# Altium schematic sheet 1_P1.schdoc
size 309 x 223 mm; Symbol: Sheet-Symbol_A4; Device: Sheet-Symbol_A4; @Page Name: P1; @Create Date: 2023-05-10; @Page Count: 1; @Page No: 1; @Project Name: 大创第一版1; @Schematic Name: Schematic1; @Update Date: 2023-05-30; Company: 嘉立创EDA; Page Size: A4; Version: V1.0
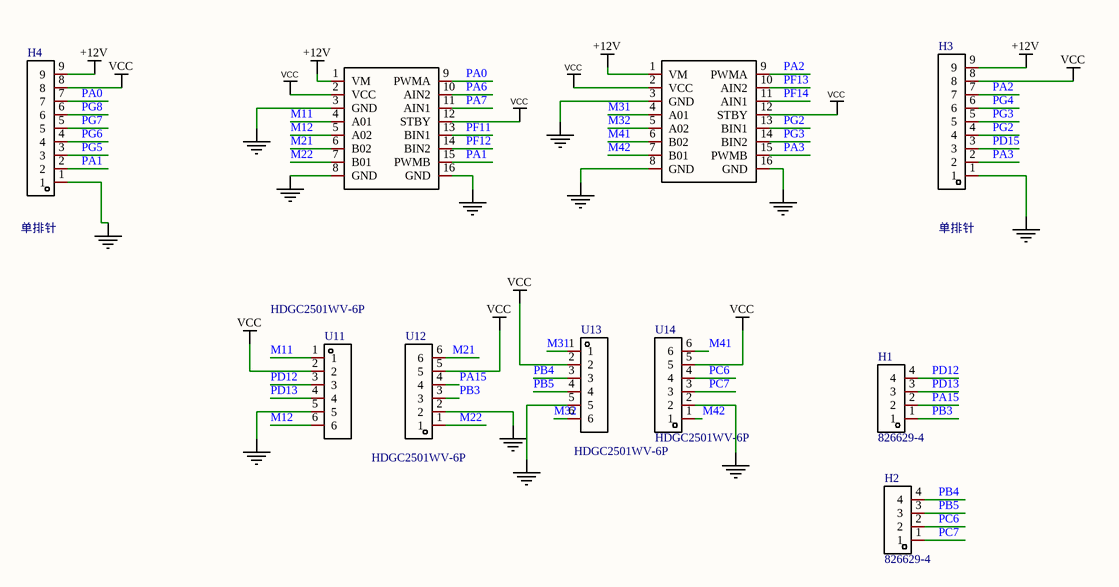
[diagram p0: 1_P1.schdoc]

## Parts
H1  826629-4  [HDR-TH_4P-P2.54-V-M-1]
H2  826629-4  [HDR-TH_4P-P2.54-V-M-1]
H3  单排针  [排针2.54MM9P]
H4  单排针  [排针2.54MM9P]
U7  TB6612  [TB6612]  (value not drawn)
U8  TB6612  [TB6612]  (value not drawn)
U11  HDGC2501WV-6P  [CONN-TH_XH2.54-6P]
U12  HDGC2501WV-6P  [CONN-TH_XH2.54-6P]
U13  HDGC2501WV-6P  [CONN-TH_XH2.54-6P]
U14  HDGC2501WV-6P  [CONN-TH_XH2.54-6P]

## Nets
+12V: H3.9 H4.9 U7.1(VM) U8.1(VM)
GND: H3.1 H4.1 U7.3(GND) U7.8(GND) U7.16(GND) U8.3(GND) U8.8(GND) U8.16(GND) U11.5 U12.2 U13.5 U14.2
VCC: H3.8 H4.8 U7.2(VCC) U7.12(STBY) U8.2(VCC) U8.12(STBY) U11.2 U12.5 U13.2 U14.5
M11: U7.4(A01) U11.1
M12: U7.5(A02) U11.6
M21: U7.6(B02) U12.6
M22: U7.7(B01) U12.1
M31: U8.4(A01) U13.1
M32: U8.5(A02) U13.6
M41: U8.6(B02) U14.6
M42: U8.7(B01) U14.1
PA0: H4.7 U7.9(PWMA)
PA1: H4.2 U7.15(PWMB)
PA2: H3.7 U8.9(PWMA)
PA3: H3.2 U8.15(PWMB)
PA6: U7.10(AIN2)
PA7: U7.11(AIN1)
PA15: H1.2 U12.4
PB3: H1.1 U12.3
PB4: H2.4 U13.3
PB5: H2.3 U13.4
PC6: H2.2 U14.4
PC7: H2.1 U14.3
PD12: H1.4 U11.3
PD13: H1.3 U11.4
PD15: H3.3
PF11: U7.13(BIN1)
PF12: U7.14(BIN2)
PF13: U8.10(AIN2)
PF14: U8.11(AIN1)
PG2: H3.4 U8.13(BIN1)
PG3: H3.5 U8.14(BIN2)
PG4: H3.6
PG5: H4.3
PG6: H4.4
PG7: H4.5
PG8: H4.6

## Notes on the sheet
- 1
- 2
- 3
- 4
- 5
- 6
- A
- B
- C
- Schematic
- Schematic1
- Create Date
- Update Date
- 2023-05-10
- 2023-05-30
- Reviewed
- Drawed
- Page
- P1
- Part Number
- 大创第一版1
- D
- VER
- SIZE
- PAGE
- OF
- V1.0
- A4
- 嘉立创EDA

## Library data of the parts
H1 H2 = 排针2: 排数:单排;总PIN位数:4;间距:2.54mm;插针结构:1x4P;行距:-;安装类型:直插;圆针/方针:-;额定电流:-;额定电压:-;配合针长度:6.7mm;塑高:2.8mm;端接针长度:3.2mm;触头材质:-;工作温度范围:-;颜色:绿色;; Manufacturer: TE Connectivity(美国泰科); Add into BOM: yes; Pitch: 2.54mm; Pin Structure: 1x4P; Name: 826629-4; Symbol: 排针2; Device: 排针2; Convert to PCB: yes; LCSC Part Name: 2.54mm 1x4P 直插; Supplier Part: C590277; Manufacturer Part: 826629-4; Supplier Footprint: 插件,P=2.54mm; JLCPCB Part Class: 扩展库; Datasheet: https://atta.szlcsc.com/upload/public/pdf/source/20210923/FCC8CD9A04BA2624CF68C067B4A5B53A.pdf; Supplier: LCSC; Number of Rows: 单排; Number of Pins: 4; Row Spacing: -; Mounting Type: 直插; Circluar Pins/Square Pins: -; Current Rating (Max): -; Voltage Rating (Max): -; Length of Mating Pin: 6.7mm; Insulation Height: 2.8mm; Length of End Connection Pin: 3.2mm; Contact Material: -; Operating Temperature Range: -; Color: 绿色
H3 H4 = 排针9P-2.54MM直插: Add into BOM: yes; Value: 0.0225; Name: 单排针; Symbol: 排针9P-2.54MM直插; Device: 排针9P-2.54MM直插; Supplier: 吉友; Convert to PCB: yes; Price: 0.045
U7 U8 = TB6612: Add into BOM: yes; _: 3; Name: TB6612; Symbol: TB6612; Device: TB6612; Convert to PCB: yes
U11-U14 = HDGC2501WV-6P: Manufacturer: HDGC(华德共创); Add into BOM: yes; Name: HDGC2501WV-6P; Symbol: HDGC2501WV-6P; Device: HDGC2501WV-6P; LCSC Part Name: XH2.5直针 6P; Supplier Part: C5175252; Manufacturer Part: HDGC2501WV-6P; Supplier Footprint: 插件,P=2.5mm; JLCPCB Part Class: Extended Part; Datasheet: https://atta.szlcsc.com/upload/public/pdf/source/20220916/91D5AD74F1294F16AD59E87ECE3C1C9F.pdf; Supplier: LCSC; Convert to PCB: yes